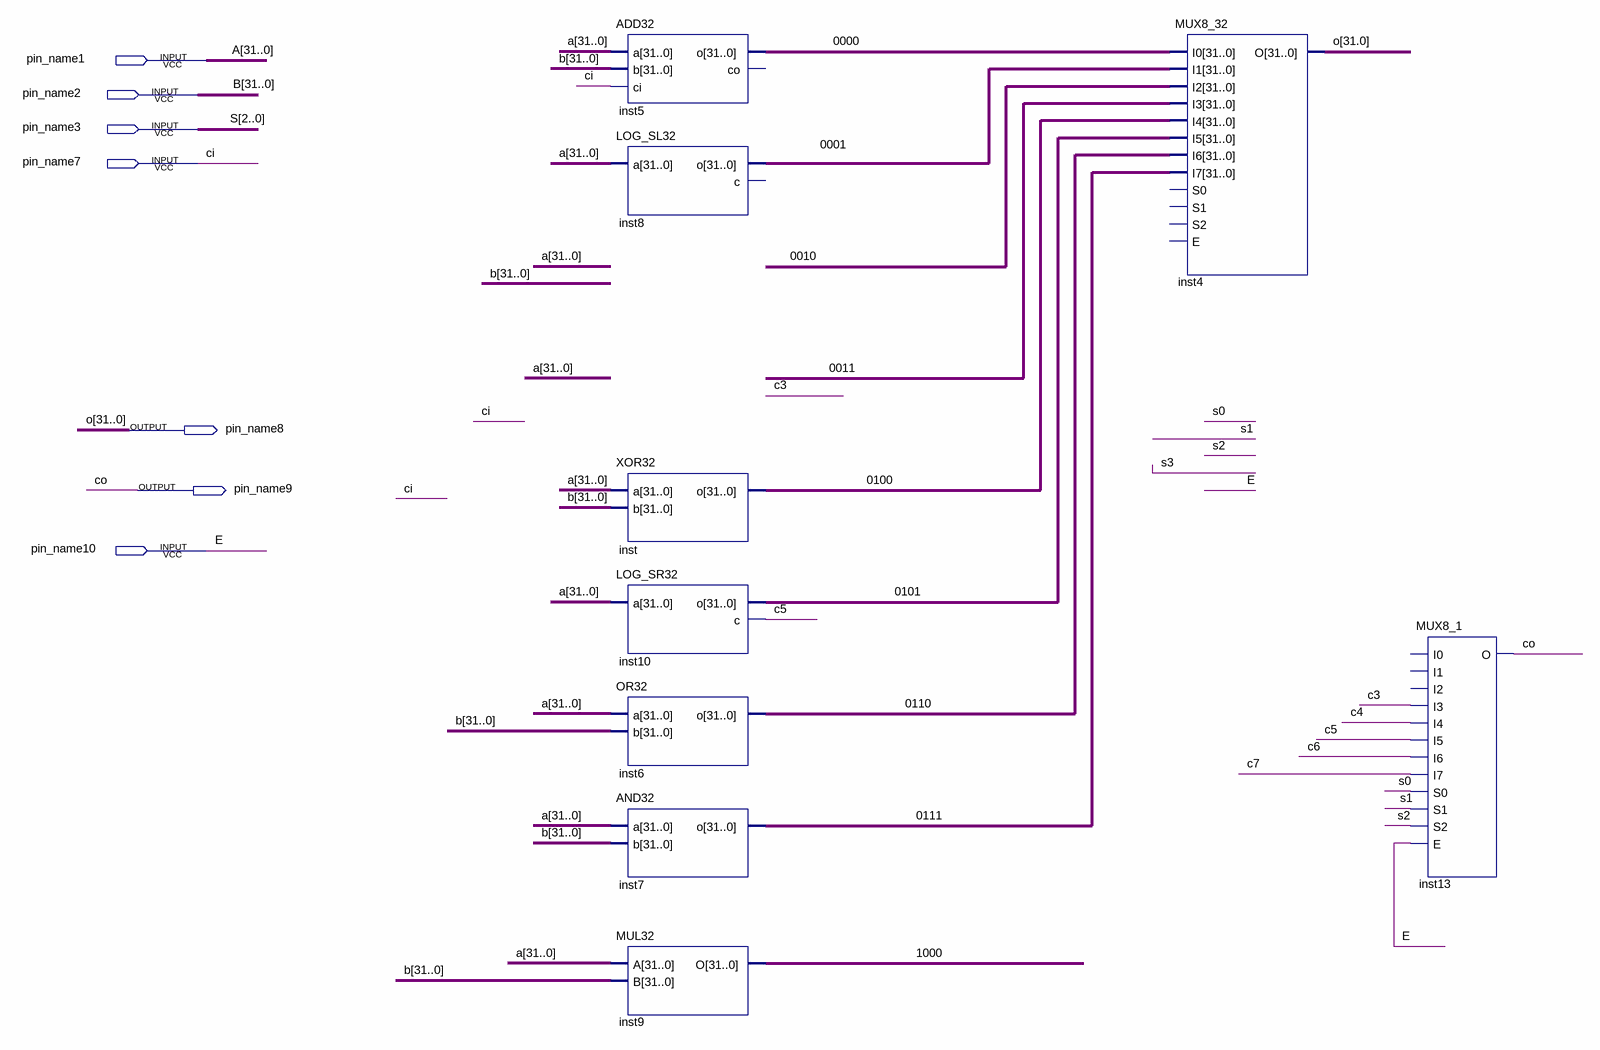
[diagram p0: schematic sheet]
// Quartus schematic ALU32.bdf as structural Verilog: 9 symbols, 7 pins
module ALU32 (
  input  pin_name1,
  input  pin_name2,
  input  pin_name3,
  input  pin_name7,
  input  pin_name10,
  output pin_name8,
  output pin_name9
);

  wire \0000 , \0001 , \0010 , \0011 , \0100 , \0101 , \0110 , \0111 , \1000 , c3, c4, c5, c6, c7, \o[31.0] ;
  wire [2:0] S;
  wire [31:0] a, b;

  ADD32 inst5 (.a(a), .b(b), .ci(pin_name7), .o(\0000 ));  // open: co
  LOG_SL32 inst8 (.a(a), .o(\0001 ));  // open: c
  XOR32 inst (.a(a), .b(b), .o(\0100 ));
  LOG_SR32 inst10 (.a(a), .o(\0101 ), .c(c5));
  OR32 inst6 (.a(a), .b(b), .o(\0110 ));
  AND32 inst7 (.a(a), .b(b), .o(\0111 ));
  MUL32 inst9 (.A(a), .B(b), .O(\1000 ));
  MUX8_32 inst4 (
    .I0({32{\0000 }}), .I1({32{\0001 }}), .I2({32{\0010 }}), .I3({32{\0011 }}), .I4({32{\0100 }}),
    .I5({32{\0101 }}), .I6({32{\0110 }}), .I7({32{\0111 }}), .O(\o[31.0] ));  // open: S0, S1, S2, E
  MUX8_1 inst13 (
    .I3(c3), .I4(c4), .I5(c5), .I6(c6), .I7(c7), .S0(S[0]), .S1(S[1]), .S2(S[2]), .E(pin_name10),
    .O(pin_name9));  // open: I0, I1, I2

  // Other names for the same wires on the sheet: ci = pin_name7; co = pin_name9; E = pin_name10
endmodule
